# Altium schematic sheet Схема принципиальная.SchDoc
size 209 x 297 mm; Наименование организации: SmartThings; Наименование изделия 1: SmartHeat Outdoor; Наименование изделия 2: Схема электрическая; Наименование изделия 3: принципиальная
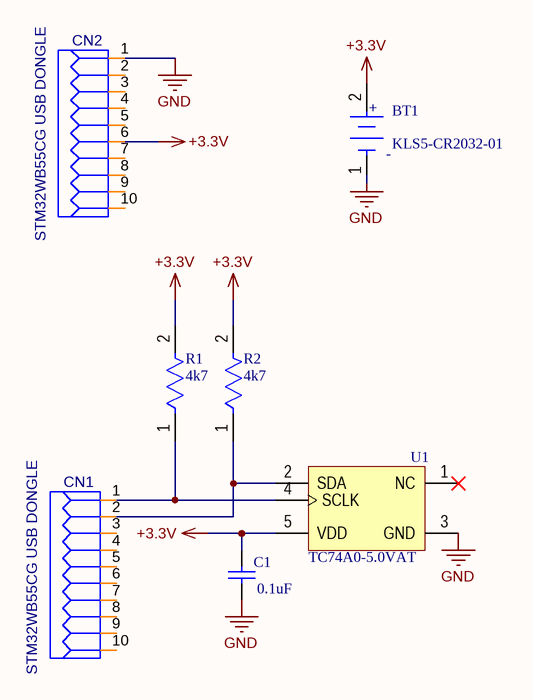
[diagram p0: Схема принципиальная.SchDoc]

## Parts
BT1  KLS5-CR2032-01  [FP-BU2032SM-HD-G-MFG]
C1  0.1uF  [CAPC2013X140X45NL15T25]
CN1  PBS-10  [PBS-10]  (value not drawn)
CN2  PBS-10  [PBS-10]  (value not drawn)
R1  4k7  [FP-CR0805-IPC_C]
R2  4k7  [FP-CR0805-IPC_C]
U1  TC74A0-5.0VAT  [TO-220-AT5]

## Nets
+3.3V: BT1.2(A) C1.2 CN2.6 R1.2 R2.2 U1.5(VDD)
GND: BT1.1(C) C1.1 CN2.1 U1.3(GND)
NetCN1_1: CN1.1 R1.1 U1.4(SCLK)
NetCN1_2: CN1.2 R2.1 U1.2(SDA)

Not connected (* = marked no-connect by the designer): CN1 3 4 5 6 7 8 9 10; CN2 2 3 4 5 7 8 9 10; U1 1(NC)*

## Notes on the sheet
- (near CN2) STM32WB55CG USB DONGLE
- (near CN1) STM32WB55CG USB DONGLE
- Перв. примен.
- Справ. №
- Подп. и дата
- Инв. № дубл.
- Взам. инв. №
- Разраб.
- Изм.
- Лист
- № докум.
- Подп.
- Дата
- Лит.
- Масса
- Масштаб
- Пров.
- Т.контр.
- Листов
- Инв. № подл.
- Утв.
- Н.контр.
- Копировал
- Формат А4
- (in symbol CMP-136216-000005-1) +; -

## Library data of the parts
BT1 = CMP-136216-000005-1: Number of Cells: 1; Termination: SMD/SMT; Min Operating Temperature: -40°C; Case/Package: SMD/SMT; Diameter: 20mm; Package Quantity: 1; Lead Free: Lead Free; Mount: Surface Mount; Packaging: Cut Tape; Max Operating Temperature: 280°C
C1 = CMP-2007-03401-1: GRM21BR71H104K / 0.1 мкФ X7R 10% 50В 0805; Part Number: GRM21BR71C475KA73L; Manufacturer: Murata
CN1 CN2 = PBS-10: 2.54mm; Note: Connector; Temp.Characteristic: -40C to +85C; Value: *; Publisher: Catcatcat Electronics; Website developer: http://catcatcat.d-lan.dp.ua/; Assembly type: Manual Part
R1 R2 = CMP-07231-005922-1: 0805 300kΩ 0.125W 1%; Power Rating: 125mW; Voltage Rating: 150V; Temperature Coefficient: 100ppm/°C; Resistance: 300kR; Max Power Dissipation: 125mW; Tolerance: 1%; Radiation Hardening: No; Max Operating Temperature: 155°C; Contact Plating: Tin; Length: 2mm; Military Standard: Not; Depth: 1.25mm; Min Operating Temperature: -55°C; Package Quantity: 1; Number of Terminations: 2; Composition: Thick Film; Packaging: Tape and Reel; Mount: Surface Mount; Case/Package: 0805; Thickness: 508um; Case Code (Imperial): 0805; Features: Moisture Resistant; Case Code (Metric): 2012; Width: 0.049inch; Height: 0.024inch; Termination: SMD/SMT
U1 = CMP-0192-00338-1: Tiny Serial Digital Thermal Sensor, 5-Pin TO-220, Extended Temperature; PackageReference: TO-220-AT5; PackageDescription: 5-Lead Plastic Transistor Outline (AT) [TO-220]; DatasheetVersion: revC, Oct-2002; PackageVersion: revBB, Aug-2009